# EAGLE design BaseBoard (EAGLE 9.5.1)

## Sheet 1 of 6
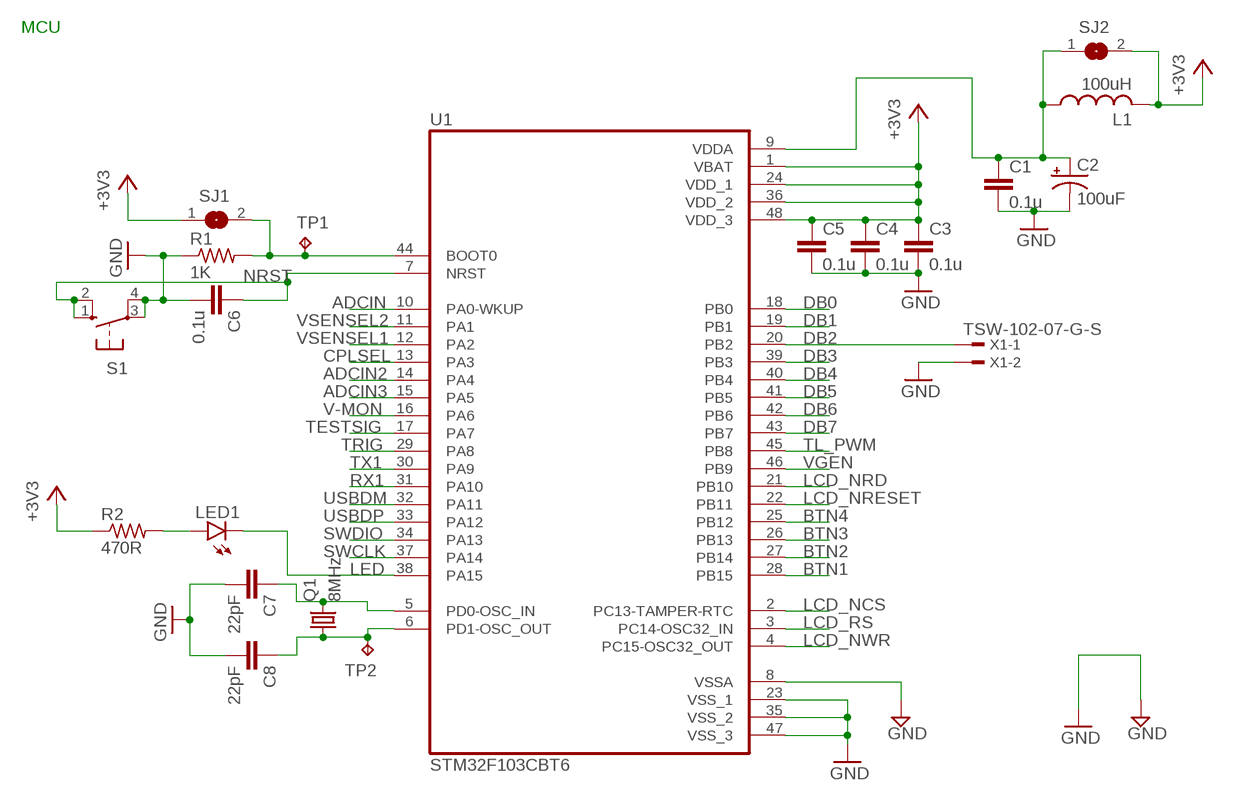
[diagram p0: schematic, sheet 1]

### Parts
C1  0.1u  C-EUC1206  [C1206]
C2  100uF  CPOL-USCT6032  [CT6032]
C3  0.1u  C-EUC1206  [C1206]
C4  0.1u  C-EUC1206  [C1206]
C5  0.1u  C-EUC1206  [C1206]
C6  0.1u  C-EUC1206  [C1206]
C7  22pF  C-EUC1206  [C1206]
C8  22pF  C-EUC1206  [C1206]
L1  100uH  L-US0204/5  [0204/5]
LED1  LEDCHIPLED_1206  [CHIPLED_1206]
Q1  8MHz  CRYSTALHC49S  [HC49/S]
R1  1K  R-US_R0805  [R0805]
R2  470R  R-US_R0805  [R0805]
S1  10-XX  [B3F-10XX]
SJ1  SJW  [SJW]
SJ2  SJW  [SJW]
TP1  TPB1,27  [B1,27]
TP2  TPB1,27  [B1,27]
U1  STM32F103CBT6  [QFP50P900X900X160-48N]
X1  TSW-102-07-G-S  [TSW-102-XX-G-S]

### Nets
+3V3: C3.1 C4.1 C5.1 L1.2 R2.1 SJ1.1 SJ2.2 U1.1(VBAT) U1.24(VDD_1) U1.36(VDD_2) U1.48(VDD_3) ; also sheet 2,3,4,5,6
ADCIN: U1.10(PA0-WKUP) ; also sheet 6
ADCIN2: U1.14(PA4) ; also sheet 6
ADCIN3: U1.15(PA5) ; also sheet 6
BTN1: U1.28(PB15) ; also sheet 5,6
BTN2: U1.27(PB14) ; also sheet 5,6
BTN3: U1.26(PB13) ; also sheet 5,6
BTN4: U1.25(PB12) ; also sheet 5,6
CPLSEL: U1.13(PA3) ; also sheet 6
DB0: U1.18(PB0) ; also sheet 3,6
DB1: U1.19(PB1) ; also sheet 3,6
DB2: U1.20(PB2) X1.1 ; also sheet 3,6
DB3: U1.39(PB3) ; also sheet 3,6
DB4: U1.40(PB4) ; also sheet 3,6
DB5: U1.41(PB5) ; also sheet 3,6
DB6: U1.42(PB6) ; also sheet 3,6
DB7: U1.43(PB7) ; also sheet 3,6
GND: C1.2 C2.- C3.2 C4.2 C5.2 C6.2 C7.2 C8.2 R1.1 S1.3(P) S1.4(P1) U1.8(VSSA) U1.23(VSS_1) U1.35(VSS_2) U1.47(VSS_3) X1.2 ; also sheet 2,3,4,5,6
LCD_NCS: U1.2(PC13-TAMPER-RTC) ; also sheet 3
LCD_NRD: U1.21(PB10) ; also sheet 3,6
LCD_NRESET: U1.22(PB11) ; also sheet 3,6
LCD_NWR: U1.4(PC15-OSC32_OUT) ; also sheet 3
LCD_RS: U1.3(PC14-OSC32_IN) ; also sheet 3
LED: LED1.C U1.38(PA15) ; also sheet 5
N$1: C1.1 C2.+ L1.1 SJ2.1 U1.9(VDDA)
N$2: LED1.A R2.2
N$21: R1.2 SJ1.2 TP1.TP U1.44(BOOT0)
N$22: C7.1 Q1.2 U1.5(PD0-OSC_IN)
N$23: C8.1 Q1.1 TP2.TP U1.6(PD1-OSC_OUT)
NRST: C6.1 S1.1(S) S1.2(S1) U1.7(NRST) ; also sheet 5
RX1: U1.31(PA10) ; also sheet 4,6
SWCLK: U1.37(PA14) ; also sheet 4,6
SWDIO: U1.34(PA13) ; also sheet 4,6
TESTSIG: U1.17(PA7) ; also sheet 4,6
TL_PWM: U1.45(PB8) ; also sheet 6
TRIG: U1.29(PA8) ; also sheet 6
TX1: U1.30(PA9) ; also sheet 4,6
USBDM: U1.32(PA11) ; also sheet 4,6
USBDP: U1.33(PA12) ; also sheet 4,6
V-MON: U1.16(PA6) ; also sheet 2,6
VGEN: U1.46(PB9) ; also sheet 2,6
VSENSEL1: U1.12(PA2) ; also sheet 6
VSENSEL2: U1.11(PA1) ; also sheet 6

### Notes on the sheet
- MCU

## Sheet 2 of 6
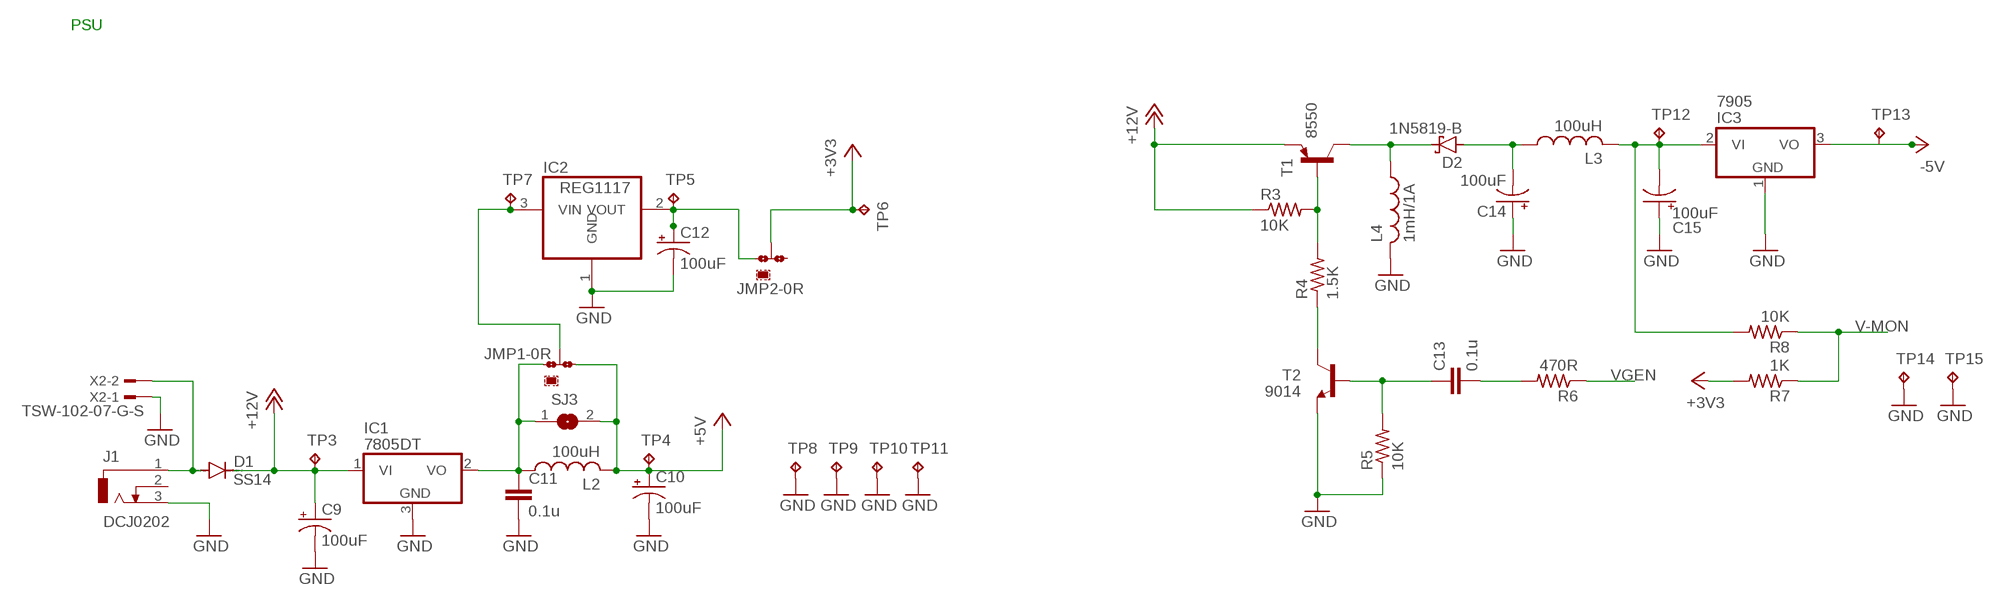
[diagram p1: schematic, sheet 2]

### Parts
C9  100uF  CPOL-USCT6032  [CT6032]
C10  100uF  CPOL-USCT6032  [CT6032]
C11  0.1u  C-EUC1206  [C1206]
C12  100uF  CPOL-USCT6032  [CT6032]
C13  0.1u  C-EUC1206  [C1206]
C14  100uF  CPOL-USCT6032  [CT6032]
C15  100uF  CPOL-USCT6032  [CT6032]
D1  SS14  ES2D  [SMB]
D2  1N5819-B  [DO41-7.6]
IC1  7805DT  [TO252]
IC2  REG1117  [SOT223]
IC3  7905  79L05Z  [TO92]
J1  DCJ0202  [DCJ0202]
JMP1  0R-JUMPA  [A0R-JMP]
JMP2  0R-JUMPA  [A0R-JMP]
L2  100uH  L-US0204/5  [0204/5]
L3  100uH  L-US0204/5  [0204/5]
L4  1mH/1A  L-US6000-XXX-RC  [6000-XXXX-RC]
R3  10K  R-US_R0805  [R0805]
R4  1.5K  R-US_R0805  [R0805]
R5  10K  R-US_R0805  [R0805]
R6  470R  R-US_R0805  [R0805]
R7  1K  R-US_R0805  [R0805]
R8  10K  R-US_R0805  [R0805]
SJ3  SJW  [SJW]
T1  8550  -PNP-TO92  [TO92]
T2  9014  -NPN-TO92  [TO92]
TP3  TPB1,27  [B1,27]
TP4  TPB1,27  [B1,27]
TP5  TPB1,27  [B1,27]
TP6  TPB1,27  [B1,27]
TP7  TPB1,27  [B1,27]
TP8  TPB1,27  [B1,27]
TP9  TPB1,27  [B1,27]
TP10  TPB1,27  [B1,27]
TP11  TPB1,27  [B1,27]
TP12  TPB1,27  [B1,27]
TP13  TPB1,27  [B1,27]
TP14  TPB1,27  [B1,27]
TP15  TPB1,27  [B1,27]
X2  TSW-102-07-G-S  [TSW-102-XX-G-S]

### Nets
+3V3: JMP2.2 R7.2 TP6.TP ; also sheet 1,3,4,5,6
+5V: C10.+ JMP1.3 L2.2 SJ3.2 TP4.TP ; also sheet 3,6
+12V: C9.+ D1.C IC1.1(VI) R3.1 T1.1(E) TP3.TP ; also sheet 3
-5V: IC3.3(VO) TP13.TP ; also sheet 6
GND: C9.- C10.- C11.2 C12.- C14.+ C15.+ IC1.3(GND) IC2.1(GND) IC3.1(GND) J1.3 L4.2 R5.1 T2.1(E) TP8.TP TP9.TP TP10.TP TP11.TP TP14.TP TP15.TP X2.1 ; also sheet 1,3,4,5,6
N$3: C11.1 IC1.2(VO) JMP1.1 L2.1 SJ3.1
N$4: R3.2 R4.2 T1.2(B)
N$5: C12.+ IC2.2(VOUT) JMP2.1 TP5.TP
N$6: R4.1 T2.3(C)
N$7: C13.1 R5.2 T2.2(B)
N$9: IC2.3(VIN) JMP1.2 TP7.TP
N$10: C13.2 R6.2
N$11: D2.C L4.1 T1.3(C)
N$12: C14.- D2.A L3.1
N$13: C15.- IC3.2(VI) L3.2 R8.2 TP12.TP
N$17: D1.A J1.1 X2.2
V-MON: R7.1 R8.1 ; also sheet 1,6
VGEN: R6.1 ; also sheet 1,6
Unconnected: J1.2 JMP2.3

### Notes on the sheet
- PSU

## Sheet 3 of 6
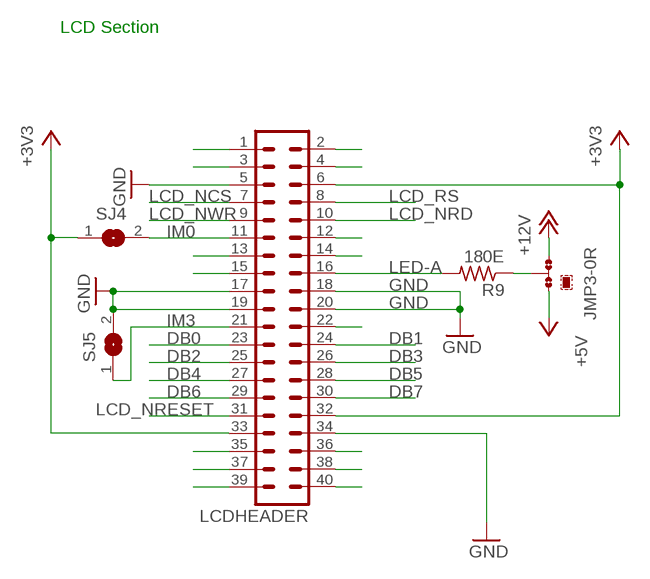
[diagram p2: schematic, sheet 3]

### Parts
JMP3  0R-JUMPA  [A0R-JMP]
LCDHEADER  MA20-2  [MA20-2]
R9  180E  R-US_R0805  [R0805]
SJ4  SJ  [SJ]
SJ5  SJ  [SJ]

### Nets
+3V3: LCDHEADER.6 LCDHEADER.32 LCDHEADER.33 SJ4.1 ; also sheet 1,2,4,5,6
+5V: JMP3.1 ; also sheet 2,6
+12V: JMP3.3 ; also sheet 2
DB0: LCDHEADER.23 ; also sheet 1,6
DB1: LCDHEADER.24 ; also sheet 1,6
DB2: LCDHEADER.25 ; also sheet 1,6
DB3: LCDHEADER.26 ; also sheet 1,6
DB4: LCDHEADER.27 ; also sheet 1,6
DB5: LCDHEADER.28 ; also sheet 1,6
DB6: LCDHEADER.29 ; also sheet 1,6
DB7: LCDHEADER.30 ; also sheet 1,6
GND: LCDHEADER.5 LCDHEADER.17 LCDHEADER.18 LCDHEADER.19 LCDHEADER.20 LCDHEADER.34 SJ5.2 ; also sheet 1,2,4,5,6
IM0: LCDHEADER.11 SJ4.2
IM3: LCDHEADER.21 SJ5.1
LCD_NCS: LCDHEADER.7 ; also sheet 1
LCD_NRD: LCDHEADER.10 ; also sheet 1,6
LCD_NRESET: LCDHEADER.31 ; also sheet 1,6
LCD_NWR: LCDHEADER.9 ; also sheet 1
LCD_RS: LCDHEADER.8 ; also sheet 1
LED-A: LCDHEADER.16 R9.2
LED-K1: LCDHEADER.15
N$14: LCDHEADER.2
N$15: LCDHEADER.4
N$16: JMP3.2 R9.1
N$19: LCDHEADER.12
N$20: LCDHEADER.14
N$28: LCDHEADER.22
N$35: LCDHEADER.36
N$36: LCDHEADER.38
N$37: LCDHEADER.40
N$38: LCDHEADER.1
N$39: LCDHEADER.3
N$44: LCDHEADER.13
N$55: LCDHEADER.35
N$56: LCDHEADER.37
N$57: LCDHEADER.39

### Notes on the sheet
- LCD Section

## Sheet 4 of 6
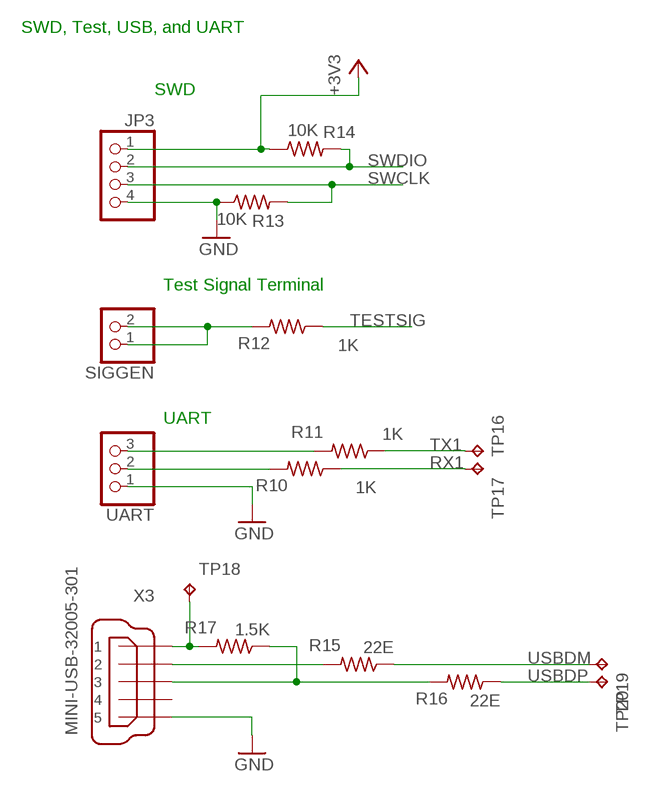
[diagram p3: schematic, sheet 4]

### Parts
JP3  PINHD-1X4  [1X04]
R10  1K  R-US_R0805  [R0805]
R11  1K  R-US_R0805  [R0805]
R12  1K  R-US_R0805  [R0805]
R13  10K  R-US_R0805  [R0805]
R14  10K  R-US_R0805  [R0805]
R15  22E  R-US_R0805  [R0805]
R16  22E  R-US_R0805  [R0805]
R17  1.5K  R-US_R0805  [R0805]
SIGGEN  PINHD-1X2  [1X02]
TP16  TPB1,27  [B1,27]
TP17  TPB1,27  [B1,27]
TP18  TPB1,27  [B1,27]
TP19  TPB1,27  [B1,27]
TP20  TPB1,27  [B1,27]
UART  PINHD-1X3  [1X03]
X3  MINI-USB-32005-301  [32005-301]

### Nets
+3V3: JP3.1 R14.1 ; also sheet 1,2,3,5,6
GND: JP3.4 R13.1 UART.1 X3.5 ; also sheet 1,2,3,5,6
N$8: R10.2 UART.2
N$18: R11.2 UART.3
N$25: R12.2 SIGGEN.1 SIGGEN.2
N$26: R17.2 TP18.TP X3.1
N$27: R16.2 R17.1 X3.3
N$29: R15.2 X3.2
RX1: R10.1 TP17.TP ; also sheet 1,6
SWCLK: JP3.3 R13.2 ; also sheet 1,6
SWDIO: JP3.2 R14.2 ; also sheet 1,6
TESTSIG: R12.1 ; also sheet 1,6
TX1: R11.1 TP16.TP ; also sheet 1,6
USBDM: R15.1 TP19.TP ; also sheet 1,6
USBDP: R16.1 TP20.TP ; also sheet 1,6
Unconnected: X3.4

### Notes on the sheet
- SWD, Test, USB, and UART
- SWD
- Test Signal Terminal
- UART

## Sheet 5 of 6
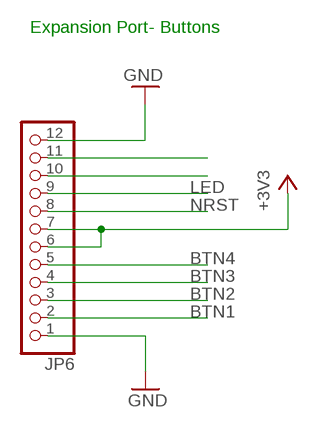
[diagram p4: schematic, sheet 5]

### Parts
JP6  PINHD-1X12  [1X12]

### Nets
+3V3: JP6.6 JP6.7 ; also sheet 1,2,3,4,6
BTN1: JP6.2 ; also sheet 1,6
BTN2: JP6.3 ; also sheet 1,6
BTN3: JP6.4 ; also sheet 1,6
BTN4: JP6.5 ; also sheet 1,6
GND: JP6.1 JP6.12 ; also sheet 1,2,3,4,6
LED: JP6.9 ; also sheet 1
N$41: JP6.10
N$42: JP6.11
NRST: JP6.8 ; also sheet 1

### Notes on the sheet
- Expansion Port- Buttons

## Sheet 6 of 6
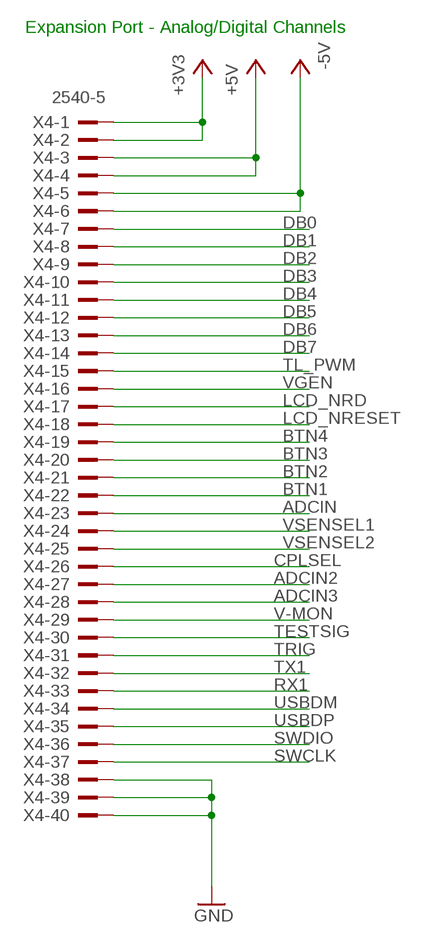
[diagram p5: schematic, sheet 6]

### Parts
X4  2540-5  [PAK100/2500-5-40]

### Nets
+3V3: X4.1 X4.2 ; also sheet 1,2,3,4,5
+5V: X4.3 X4.4 ; also sheet 2,3
-5V: X4.5 X4.6 ; also sheet 2
ADCIN: X4.23 ; also sheet 1
ADCIN2: X4.27 ; also sheet 1
ADCIN3: X4.28 ; also sheet 1
BTN1: X4.22 ; also sheet 1,5
BTN2: X4.21 ; also sheet 1,5
BTN3: X4.20 ; also sheet 1,5
BTN4: X4.19 ; also sheet 1,5
CPLSEL: X4.26 ; also sheet 1
DB0: X4.7 ; also sheet 1,3
DB1: X4.8 ; also sheet 1,3
DB2: X4.9 ; also sheet 1,3
DB3: X4.10 ; also sheet 1,3
DB4: X4.11 ; also sheet 1,3
DB5: X4.12 ; also sheet 1,3
DB6: X4.13 ; also sheet 1,3
DB7: X4.14 ; also sheet 1,3
GND: X4.38 X4.39 X4.40 ; also sheet 1,2,3,4,5
LCD_NRD: X4.17 ; also sheet 1,3
LCD_NRESET: X4.18 ; also sheet 1,3
RX1: X4.33 ; also sheet 1,4
SWCLK: X4.37 ; also sheet 1,4
SWDIO: X4.36 ; also sheet 1,4
TESTSIG: X4.30 ; also sheet 1,4
TL_PWM: X4.15 ; also sheet 1
TRIG: X4.31 ; also sheet 1
TX1: X4.32 ; also sheet 1,4
USBDM: X4.34 ; also sheet 1,4
USBDP: X4.35 ; also sheet 1,4
V-MON: X4.29 ; also sheet 1,2
VGEN: X4.16 ; also sheet 1,2
VSENSEL1: X4.24 ; also sheet 1
VSENSEL2: X4.25 ; also sheet 1

### Notes on the sheet
- Expansion Port - Analog/Digital Channels

## Library data of the parts
C1 C3-C8 C11 C13 = rcl:C-EU: CAPACITOR, European symbol; SPICEPREFIX: C
C2 C9 C10 C12 C14 C15 = rcl:CPOL-US: POLARIZED CAPACITOR, American symbol; SPICEPREFIX: C
D1 = diode:ES2D: DIODE super fast rectifier, 2 A
D2 = diode:1N581*: 1.0A SCHOTTKY BARRIER RECTIFIER Source: http://www.diodes.com/datasheets/ds23001.pdf
IC1 = linear:78*: Positive VOLTAGE REGULATOR Source: http://cache.national.com/ds/LM/LM78L05.pdf http://www.fairchildsemi.com/ds/LM/LM7805.pdf
IC2 = burr-brown:REG1117: 800mA and 1A Low Dropout (LDO) Positive Regulator 1.8V, 2.5V, 2.85V, 3.3V, 5V, and Adj; MPN: REG1117; OC_FARNELL: 1097566; OC_NEWARK: 14P6981
IC3 = linear:79*: Negative VOLTAGE REGULATOR
J1 = con-jack:DCJ0202: DC POWER JACK Source: DCJ0202.pdf; OC_FARNELL: unknown; OC_NEWARK: unknown
JMP1-JMP3 = jump-0r-smd:0R-JUMP: SMD 0R 0805 Jumper
JP3 = pinhead:PINHD-1X4: PIN HEADER
JP6 = pinhead:PINHD-1X12: PIN HEADER
L1-L4 = rcl:L-US: INDUCTOR, American symbol; SPICEPREFIX: L
LCDHEADER = con-lstb:MA20-2: PIN HEADER; OC_FARNELL: unknown; OC_NEWARK: unknown
LED1 = led:LED: LED OSRAM: - CHIPLED LG R971, LG N971, LY N971, LG Q971, LY Q971, LO R971, LY R971 LH N974, LH R974 LS Q976, LO Q976, LY Q976 LO Q996 - Hyper CHIPLED LW Q18S LB Q993, LB Q99A, LB R99A - SideLED LS A670, LO A670, LY A670, LG A670, LP A670 LB A673, LV A673, LT A673, LW A673 LH A674 LY A675 LS A676, LA A676, LO A676, LY A676, LW A676 LS A679, LY A679, LG A679 - Hyper Micro SIDELED® LS Y876, LA Y876, LO Y876, LY Y876 LT Y87S - SmartLED LW L88C, LW L88S LB L89C, LB L89S, LG L890 LS L89K, LO L89K, LY L89K LS L896, LA L896, LO L896, LY L896 - TOPLED LS T670, LO T670, LY T670, LG T670, LP T670 LSG T670, LSP T670, LSY T670, LOP T670, LYG T670 LG T671, LOG T671, LSG T671 LB T673, LV T673, LT T673, LW T673 LH T674 LS T676, LA T676, LO T676, LY T676, LB T676, LH T676, LSB T676, LW T676 LB T67C, LV T67C, LT T67C, LS T67K, LO T67K, LY T67K, LW E67C LS E67B, LA E67B, LO E67B, LY E67B, LB E67C, LV E67C, LT E67C LW T67C LS T679, LY T679, LG T679 LS T770, LO T770, LY T770, LG T770, LP T770 LB T773, LV T773, LT T773, LW T773 LH T774 LS E675, LA E675, LY E675, LS T675 LS T776, LA T776, LO T776, LY T776, LB T776 LHGB T686 LT T68C, LB T68C - Hyper Mini TOPLED® LB M676 - Mini TOPLED Santana® LG M470 LS M47K, LO M47K, LY M47K Source: http://www.osram.convergy.de LUXEON: - LUMILED® LXK2-PW12-R00, LXK2-PW12-S00, LXK2-PW14-U00, LXK2-PW14-V00 LXK2-PM12-R00, LXK2-PM12-S00, LXK2-PM14-U00 LXK2-PE12-Q00, LXK2-PE12-R00, LXK2-PE12-S00, LXK2-PE14-T00, LXK2-PE14-U00 LXK2-PB12-K00, LXK2-PB12-L00, LXK2-PB12-M00, LXK2-PB14-N00, LXK2-PB14-P00, LXK2-PB14-Q00 LXK2-PR12-L00, LXK2-PR12-M00, LXK2-PR14-Q00, LXK2-PR14-R00 LXK2-PD12-Q00, LXK2-PD12-R00, LXK2-PD12-S00 LXK2-PH12-R00, LXK2-PH12-S00 LXK2-PL12-P00, LXK2-PL12-Q00, LXK2-PL12-R00 Source: www.luxeon.com KINGBRIGHT: KA-3528ASYC Source: www.kingbright.com
Q1 = crystal:CRYSTAL: CRYSTAL; OC_FARNELL: 1667008; OC_NEWARK: unknown
R1-R17 = rcl:R-US_: RESISTOR, American symbol; SPICEPREFIX: R
S1 = switch-omron:10-XX: OMRON SWITCH; MPN: B3F-1000; OC_FARNELL: 176432; OC_NEWARK: 36M3542
SIGGEN = pinhead:PINHD-1X2: PIN HEADER
SJ1-SJ5 = jumper:SJ: SMD solder JUMPER
T1 = transistor:*-PNP-: PNP Transistror
T2 = transistor:*-NPN-: NPN Transistror BF959 corrected 2008.03.06
TP1-TP20 = testpad:TP: Test pad
U1 = STM32F103CBT6:STM32F103CBT6: Mainstream Performance line, ARM Cortex-M3 MCU with 128 Kbytes Flash, 72 MHz CPU, motor control, USB and CAN Check prices <https://pricing.snapeda.com/parts/STM32F103CBT6/STMicroelectronics/view-part?ref=eda>; AVAILABILITY: In Stock; DESCRIPTION: ARM® Cortex®-M3 STM32F1 Microcontroller IC 32-Bit 72MHz 128KB (128K x 8) FLASH; MF: STMicroelectronics; MP: STM32F103CBT6; PACKAGE: LQFP-48 STMicroelectronics; PRICE: None; PURCHASE-URL: https://pricing.snapeda.com/search/part/STM32F103CBT6/?ref=eda
UART = pinhead:PINHD-1X3: PIN HEADER
X1 X2 = con-samtec:TSW-102-*-G-S: THROUGH-HOLE .025" SQ POST HEADER Source: Samtec TSW.pdf; MF: Samtec Inc.; MPN: TSW-102-07-G-S
X3 = con-cypressindustries:MINI-USB-: MINI USB-B Conector Source: www.cypressindustries.com; OC_FARNELL: unknown; OC_NEWARK: unknown
X4 = con-3m:2540-: 3M (TM) Pak 100 4-Wall Header Source: 3M; OC_FARNELL: 9838414; OC_NEWARK: unknown

## Board
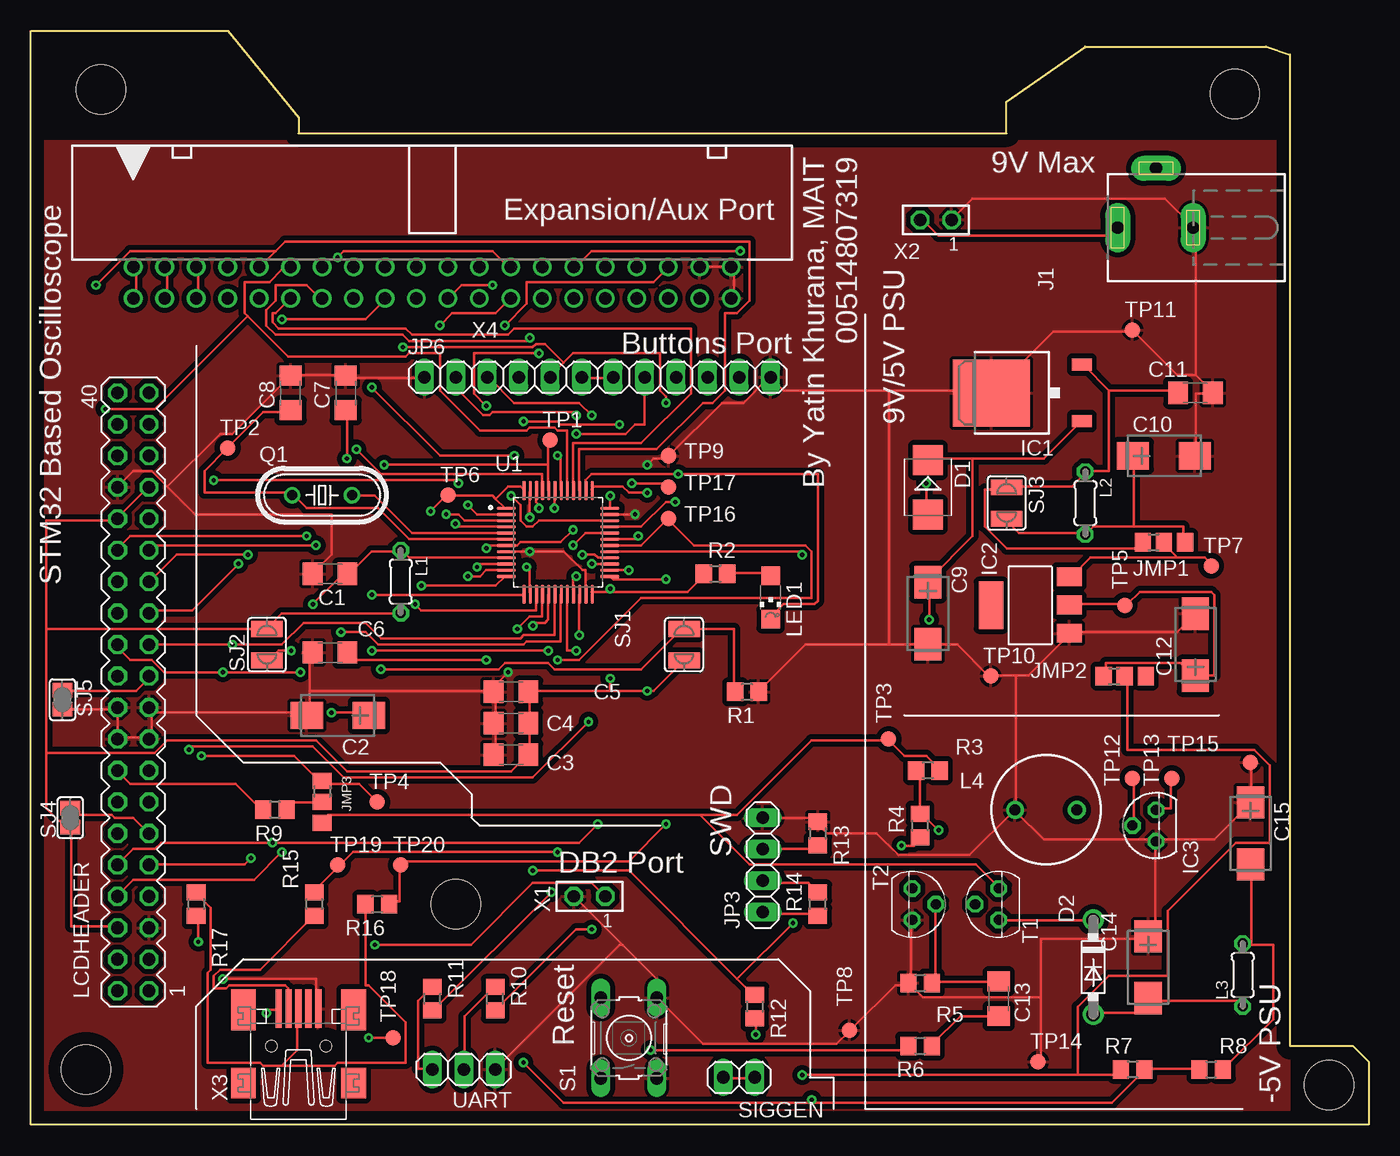
[diagram p6: board, top side]
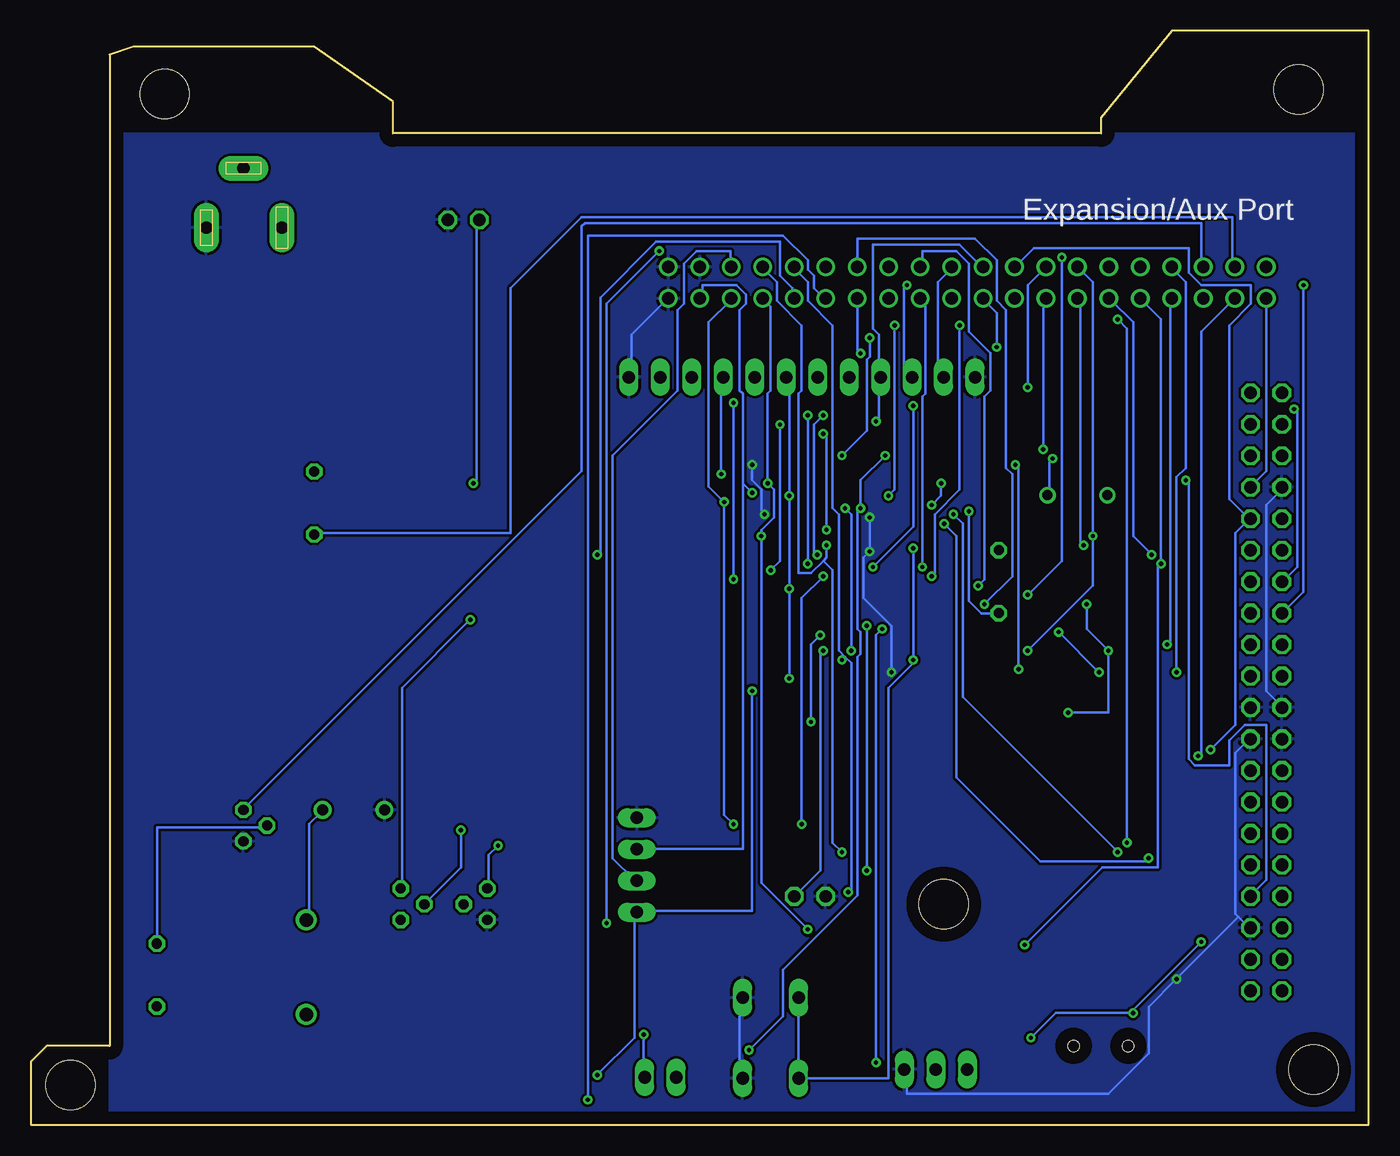
[diagram p7: board, bottom side, seen from below]

Size 107.95 x 88.27 mm. Coordinates in mm from the lower left corner, seen from the top.
Outline: 0,0 0,88.27 15.88,88.27 21.59,81.28 21.59,80.01 78.74,80.01 78.74,82.55 85.09,87 99.69,87 101.6,86.36 101.6,6.35 106.68,6.35 107.95,5.08 107.95,0 0,0
Copper layers (1*16): Top 0.035mm / dielectric 1.5mm / Bottom 0.035mm
Design rules "default *": minimum track width 8mil, minimum drill 0.35mm, track to track 8mil, track to pad 8mil, pad to pad 7mil, via to via 10mil, smd to smd 6mil, copper to edge 40mil, drill to drill 6mil, minimum pad ring 10mil, minimum via ring 8mil, stop-mask expansion 4mil, vias tented up to drill 0mil, thermal gap 10mil

### Footprints (pad centres in the part's own frame; a part is rotated, then mirrored left to right if it is on the bottom)
C1206 = smd 1.6 x 1.8: 1 -1.4,0; 2 1.4,0
CT6032 = smd 2.6 x 2.2: + -2.5,0; - 2.5,0
SMB = smd 2.4 x 2.4: A 2.2,0; C -2.2,0
DO41-7.6 = drill 1.1 pad 1.7: A 3.81,0; C -3.81,0
TO252 = smd 1 x 1.6: 1 -2.28,-4.8; 2 2.28,-4.8 | smd 5.4 x 6.2: 3 0,2.5
SOT223 = smd 1.499 x 2.007: 1 -2.261,-3.15; 2 0.025,-3.15; 3 2.311,-3.15 | smd 3.81 x 2.007: 4 0,3.15
TO92 = drill 0.813 octagon: 1 -1.27,0; 2 0,1.905; 3 1.27,0
DCJ0202 = drill 1 pad 2 long: 1 0,3.1; 2 4.8,0; 3 0,-3
A0R-JMP = smd 1.5 x 1.3: 1 0,1.7; 2 0,0; 3 0,-1.7
1X04 = drill 1.016 long: 1 -3.81,0; 2 -1.27,0; 3 1.27,0; 4 3.81,0
1X12 = drill 1.016 long: 1 -13.97,0; 2 -11.43,0; 3 -8.89,0; 4 -6.35,0; 5 -3.81,0; 6 -1.27,0; 7 1.27,0; 8 3.81,0; 9 6.35,0; 10 8.89,0; 11 11.43,0; 12 13.97,0
0204/5 = drill 0.813 octagon: 1 -2.54,0; 2 2.54,0
6000-XXXX-RC = drill 0.9 pad 1.422: 1 -2.5,0; 2 2.5,0
MA20-2 = drill 1.016 octagon: 1 -24.13,-1.27; 2 -24.13,1.27; 3 -21.59,-1.27; 4 -21.59,1.27; 5 -19.05,-1.27; 6 -19.05,1.27; 7 -16.51,-1.27; 8 -16.51,1.27; 9 -13.97,-1.27; 10 -13.97,1.27; 11 -11.43,-1.27; 12 -11.43,1.27; 13 -8.89,-1.27; 14 -8.89,1.27; 15 -6.35,-1.27; 16 -6.35,1.27; 17 -3.81,-1.27; 18 -3.81,1.27; 19 -1.27,-1.27; 20 -1.27,1.27; 21 1.27,-1.27; 22 1.27,1.27; 23 3.81,-1.27; 24 3.81,1.27; 25 6.35,-1.27; 26 6.35,1.27; 27 8.89,-1.27; 28 8.89,1.27; 29 11.43,-1.27; 30 11.43,1.27; 31 13.97,-1.27; 32 13.97,1.27; 33 16.51,-1.27; 34 16.51,1.27; 35 19.05,-1.27; 36 19.05,1.27; 37 21.59,-1.27; 38 21.59,1.27; 39 24.13,-1.27; 40 24.13,1.27
CHIPLED_1206 = smd 1.5 x 1.5: A 0,-1.75; C 0,1.75
HC49/S = drill 0.813: 1 -2.413,0; 2 2.413,0
R0805 = smd 1.3 x 1.5: 1 -0.95,0; 2 0.95,0
B3F-10XX = drill 1.016 long: 1 -3.251,2.261; 2 3.251,2.261; 3 -3.251,-2.261; 4 3.251,-2.261
1X02 = drill 1.016 long: 1 -1.27,0; 2 1.27,0
SJW = smd 1.27 x 2.54: 1 -1.27,0; 2 1.27,0
SJ = smd 1.168 x 1.6: 1 -0.762,0; 2 0.762,0
TO92' = drill 0.813 octagon: 1 1.27,0; 2 0,1.905; 3 -1.27,0
B1,27 = smd 1.27 x 1.27: TP 0,0
QFP50P900X900X160-48N = smd 1.56 x 0.28: 1 -4.18,2.75; 2 -4.18,2.25; 3 -4.18,1.75; 4 -4.18,1.25; 5 -4.18,0.75; 6 -4.18,0.25; 7 -4.18,-0.25; 8 -4.18,-0.75; 9 -4.18,-1.25; 10 -4.18,-1.75; 11 -4.18,-2.25; 12 -4.18,-2.75; 25 4.18,-2.75; 26 4.18,-2.25; 27 4.18,-1.75; 28 4.18,-1.25; 29 4.18,-0.75; 30 4.18,-0.25; 31 4.18,0.25; 32 4.18,0.75; 33 4.18,1.25; 34 4.18,1.75; 35 4.18,2.25; 36 4.18,2.75 | smd 0.28 x 1.56: 13 -2.75,-4.18; 14 -2.25,-4.18; 15 -1.75,-4.18; 16 -1.25,-4.18; 17 -0.75,-4.18; 18 -0.25,-4.18; 19 0.25,-4.18; 20 0.75,-4.18; 21 1.25,-4.18; 22 1.75,-4.18; 23 2.25,-4.18; 24 2.75,-4.18; 37 2.75,4.18; 38 2.25,4.18; 39 1.75,4.18; 40 1.25,4.18; 41 0.75,4.18; 42 0.25,4.18; 43 -0.25,4.18; 44 -0.75,4.18; 45 -1.25,4.18; 46 -1.75,4.18; 47 -2.25,4.18; 48 -2.75,4.18
DRILL_0.1560 = hole 3.962: 0,0
1X03 = drill 1.016 long: 1 -2.54,0; 2 0,0; 3 2.54,0
TSW-102-XX-G-S = drill 1 pad 1.5 octagon: 1 1.27,0; 2 -1.27,0
32005-301 = smd 3.1 x 0.5: 1 3,1.6; 2 3,0.8; 3 3,0; 4 3,-0.8; 5 3,-1.6 | smd 2.5 x 2: M1 -3,-4.45; M2 -3,4.45 | smd 3.3 x 2: M3 2.9,4.45; M4 2.9,-4.45 | hole 0.9: 0,2.2; 0,-2.2
PAK100/2500-5-40 = drill 1 pad 1.422: 1 -24.13,-1.27; 2 -24.13,1.27; 3 -21.59,-1.27; 4 -21.59,1.27; 5 -19.05,-1.27; 6 -19.05,1.27; 7 -16.51,-1.27; 8 -16.51,1.27; 9 -13.97,-1.27; 10 -13.97,1.27; 11 -11.43,-1.27; 12 -11.43,1.27; 13 -8.89,-1.27; 14 -8.89,1.27; 15 -6.35,-1.27; 16 -6.35,1.27; 17 -3.81,-1.27; 18 -3.81,1.27; 19 -1.27,-1.27; 20 -1.27,1.27; 21 1.27,-1.27; 22 1.27,1.27; 23 3.81,-1.27; 24 3.81,1.27; 25 6.35,-1.27; 26 6.35,1.27; 27 8.89,-1.27; 28 8.89,1.27; 29 11.43,-1.27; 30 11.43,1.27; 31 13.97,-1.27; 32 13.97,1.27; 33 16.51,-1.27; 34 16.51,1.27; 35 19.05,-1.27; 36 19.05,1.27; 37 21.59,-1.27; 38 21.59,1.27; 39 24.13,-1.27; 40 24.13,1.27

### Placement (x,y rotation side)
C1  24.13,44.45 180 top
C2  24.77,33.02 180 top
C3  38.73,29.84 180 top
C4  38.73,32.38 180 top
C5  38.73,34.92 180 top
C6  24.13,38.1 180 top
C7  25.4,59.05 90 top
C8  20.95,59.05 90 top
C9  72.39,41.27 270 top
C10  91.44,53.98 0 top
C11  93.98,59.05 0 top
C12  93.98,38.73 90 top
C13  78.11,10.16 270 top
C14  90.17,12.7 270 top
C15  98.42,23.5 270 top
D1  72.39,51.44 270 top
D2  85.72,12.7 270 top
IC1  80.01,59.05 90 top
IC2  80.64,41.91 90 top
IC3  90.81,24.13 90 top
J1  90.81,72.39 90 top
JMP1  91.44,46.99 90 top
JMP2  88.27,36.2 90 top
JMP3  23.5,26.04 0 top
JP3  59.05,20.95 90 top
JP6  45.72,60.33 0 top
L1  29.84,43.81 270 top
L2  85.09,50.16 270 top
L3  97.79,12.06 90 top
L4  81.92,25.4 180 top
LCDHEADER  8.26,34.92 90 top
LED1  59.69,42.55 180 top
Q1  23.5,50.8 0 top
R1  57.78,34.92 180 top
R2  55.24,44.45 0 top
R3  72.39,28.57 180 top
R4  71.75,24.13 90 top
R5  71.75,11.43 0 top
R6  71.75,6.35 0 top
R7  88.9,4.45 180 top
R8  95.25,4.45 0 top
R9  19.68,25.4 180 top
R10  37.47,10.16 90 top
R11  32.38,10.16 90 top
R12  58.42,9.53 270 top
R13  63.5,23.5 270 top
R14  63.5,17.78 90 top
R15  22.86,17.78 270 top
R16  27.94,17.78 180 top
R17  13.34,17.78 270 top
S1  48.26,6.99 90 top
SIGGEN  57.15,3.81 0 top
SJ1  52.7,38.73 90 top
SJ2  19.05,38.73 90 top
SJ3  78.74,50.16 270 top
SJ4  3.17,24.77 90 top
SJ5  2.54,34.29 270 top
T1  8550  [TO92']  78.11,17.78 90 top
T2  9014  [TO92']  71.12,17.78 270 top
TP1  41.91,55.24 0 top
TP2  15.88,54.61 0 top
TP3  69.22,31.11 90 top
TP4  27.94,26.04 0 top
TP5  88.27,41.91 0 top
TP6  33.66,50.8 0 top
TP7  95.25,45.09 0 top
TP8  66.04,7.62 0 top
TP9  51.44,53.98 0 top
TP10  77.47,36.2 0 top
TP11  88.9,64.14 0 top
TP12  88.9,27.94 90 top
TP13  92.08,27.94 0 top
TP14  81.28,5.08 0 top
TP15  98.42,29.21 90 top
TP16  51.44,48.9 0 top
TP17  51.44,51.44 0 top
TP18  29.21,6.99 0 top
TP19  24.77,20.95 0 top
TP20  29.84,20.95 0 top
U1  42.55,46.99 0 top
U$1  [DRILL_0.1560]  4.45,4.45 0 top
U$2  [DRILL_0.1560]  5.65,83.54 0 top
U$3  [DRILL_0.1560]  97.16,83.19 0 top
U$4  [DRILL_0.1560]  34.29,17.78 0 top
U$5  [DRILL_0.1560]  104.78,3.17 0 top
UART  34.92,4.45 180 top
X1  45.09,18.41 0 top
X2  73.03,73.03 0 top
X3  21.59,6.35 90 top
X4  32.38,67.94 0 top

### Tracks (layer width: path | path; a pad name or v marks a point on that pad's centre or on a via)
+3V3  (via drill 0.35)
  Top 0.203: R14.1 63.5,17 59.25,17 JP3.1 | v62.25,4 84.5,4 | 84.5,4 87.5,4 87.75,4.25 R7.2 | 84.5,4 84.5,9.5 87,12 91.75,12 91.75,17.25 97.25,22.75 100,22.75 100,29 98.75,30.25 88.5,30.25 88.5,36 JMP2.2 | 46.75,35 40.25,35 C5.1 40.25,34.75 40.25,32.5 C4.1 40.25,32.25 40.25,30 C3.1 40,29.75 38.75,28.5 25.5,28.5 23,31 11,31 10,30 1.25,30 | 46.75,35 v49.75,35 50.25,35 52.5,37.25 SJ1.1 | 46.75,43 45.25,43 U1.24 | 46.75,43 53,43 54.25,44.25 R2.1 | v46.75,50.75 46.75,49.75 U1.36 | JP6.6 44.5,60.25 46.75,60.25 JP6.7 | v46.75,43.25 46.75,43 | v46.75,36 46.75,35 | 37.5,50.5 38.25,49.75 U1.1 | 37.5,50.5 37.25,50.75 33.75,50.75 TP6.TP 33.5,50.75 v32.25,49.5 | 37.5,50.5 38.5,51.5 39.5,51.5 39.75,51.25 U1.48 | L1.2 29.75,41.25 20.25,41.25 19.25,40.25 SJ2.2 19,40 1.25,40 | LCDHEADER.6 6.75,16 3.25,16 3.25,24 SJ4.1 3,24.25 2.75,24.5 2.25,24.5 1.25,25.5 1.25,30 | X4.1 8.5,66.75 8.5,69 X4.2 | LCDHEADER.33 9.5,51.25 9.25,51.25 7,49 LCDHEADER.32 6.75,48.75 1.25,48.75 1.25,40 | 1.25,40 1.25,30
  Bottom 0.203: v62.25,4 59.25,7 59.25,17 JP3.1 59,17.25 49.75,17.25 v49.75,35 | JP6.7 46.75,60.25 v46.75,50.75 v46.75,43.25 v46.75,36 | v32.25,49.5 32.25,42.25 31.25,41.25 30,41.25 L1.2 | X4.1 8.25,66.5 8.25,52.75 9.5,51.5 LCDHEADER.33
+5V  (via drill 0.35)
  Top 0.203: 89,48.25 85.75,48.25 85.25,47.75 L2.2 85,47.75 79.75,47.75 78.75,48.75 SJ3.2 | 89,48.25 93,48.25 93,47 JMP1.3 | 89,48.25 89,53.75 C10.+ | TP4.TP 27.75,26.25 26.5,27.5 23.5,27.5 JMP3.1 23.25,27.75 21.25,29.75 v13.75,29.75 | X4.3 11,66.75 11,69 X4.4
  Bottom 0.203: v13.75,29.75 13.5,30 13.5,64 11,66.5 X4.3 | L2.2 85,47.75 69.25,47.75 69.25,67.5 63.5,73.25 11,73.25 11,69.25 X4.4
+12V  (via drill 0.35)
  Top 0.203: 76,53.75 72.5,53.75 D1.C | 76,53.75 81.75,53.75 84.75,56.75 IC1.1 | 76,53.75 76,47.5 72.5,44 C9.+ 72.5,43.75 v72.5,40.75 | R3.1 73.25,28.75 72.25,29.75 70.5,29.75 69.25,31 TP3.TP 69,31 63,31 57,25 54,25 | 54,25 24,25 23.5,24.5 JMP3.3 | 54,25 58,21 76.25,21 78,19.25 T1.1
  Bottom 0.203: v72.5,40.75 78,35.25 78,19.25 T1.1
-5V
  Top 0.203: TP13.TP 92,27.75 92,25.5 91,25.5 IC3.3 | X4.5 13.5,66.75 13.5,69 X4.6
  Bottom 0.203: IC3.3 90.75,25.5 63.5,52.75 63.5,72.5 63.25,72.75 13.5,72.75 13.5,69.25 X4.6
ADCIN  (via drill 0.35)
  Top 0.203: v36,45 36.25,45.25 38.25,45.25 U1.10
  Bottom 0.203: v36,45 36,58.75 35.75,59 35.75,66.25 36,66.5 X4.23
ADCIN2  (via drill 0.35)
  Top 0.203: v40,45 40.25,45 40.25,43 U1.14 | v36.75,58 35.75,59 35.75,62.25 v41,62.25
  Bottom 0.203: v40,45 36.75,48.25 v36.75,58 | v41,62.25 41.25,62.5 41.25,66.5 X4.27
ADCIN3  (via drill 0.35)
  Top 0.203: v31,42 31.5,41.5 40.75,41.5 40.75,42.75 U1.15
  Bottom 0.203: v31,42 28.75,44.25 28.75,52.5 29.25,53 29.25,65.75 30,66.5 30,69.75 31.75,71.5 41.25,71.5 41.25,69.25 X4.28
BTN1  (via drill 0.35)
  Top 0.203: v44.5,46 45.5,46 45.75,45.75 46.5,45.75 U1.28 | v44,57.25 43.75,57.5 37.25,57.5 37,57.25 36.5,57.25 34.5,59.25 34.5,60.25 JP6.2
  Bottom 0.203: v44.5,46 44.75,46.25 44.75,56.5 v44,57.25 | X4.22 33.75,69 34.75,68 34.75,60.75 34.5,60.5 JP6.2
BTN2  (via drill 0.35)
  Top 0.203: v45.25,45.25 46.5,45.25 U1.27 | v45.25,57.25 44.25,58.25 39,58.25 37,60.25 JP6.3 | v37.25,67.75 34.75,67.75 33.75,66.75 X4.21
  Bottom 0.203: v45.25,57.25 v45.25,45.25 | v37.25,67.75 37.5,67.5 37.5,61 37,60.5 JP6.3
BTN3  (via drill 0.35)
  Top 0.203: v48.25,44.75 46.75,44.75 U1.26 | v47.5,56.5 42.75,56.5 42.5,56.75 v39.75,56.75
  Bottom 0.203: v48.25,44.75 47.5,45.5 v47.5,56.5 | v39.75,56.75 39.5,57 39.5,60.25 JP6.4 39.5,60.5 39.5,63.75 40,64.25 40,71 33,71 31.25,69.25 X4.20
BTN4  (via drill 0.35)
  Top 0.203: v51.25,44 47,44 46.75,44.25 U1.25 | v51.25,58.25 51.25,58.75 50.75,59.25 50.75,62.25 43.75,62.25 43,61.5 | 43,61.5 42,60.5 JP6.5 | v30,62.75 40.5,62.75 40.75,63 41.5,63 43,61.5
  Bottom 0.203: v51.25,58.25 v51.25,44 | v30,62.75 30,65.5 31,66.5 X4.19
CPLSEL  (via drill 0.35)
  Top 0.203: v27.5,42.75 39.75,42.75 U1.13 | v24.75,70 25.25,70.5 37.25,70.5 38.5,69.25 X4.26
  Bottom 0.203: v27.5,42.75 24.75,45.5 v24.75,70
DB0  (via drill 0.35)
  Top 0.203: U1.18 42.25,42.75 42.25,39.5 39.75,39.5 39.5,39.25 28.25,39.25 27,40.5 22,40.5 20.25,38.75 v16.25,38.75 9.75,38.75 LCDHEADER.23
  Bottom 0.203: v16.25,38.75 16,39 16,66.5 X4.7
DB1  (via drill 0.35)
  Top 0.203: v25,39.75 27,39.75 28,38.75 39.75,38.75 40,39 42.75,39 42.75,42.75 U1.19 | v21.75,36.5 v15.5,36.5 10.75,36.5 9.75,37.5 8,37.5 7,38.5 LCDHEADER.24
  Bottom 0.203: v21.75,36.5 v25,39.75 | v15.5,36.5 15.5,52.25 14.75,53 14.75,68 15.75,69 X4.8
DB2  (via drill 0.35)
  Top 0.203: v44,38.25 43.25,38.25 43.25,42.75 U1.20 | v16.75,45.25 13,41.5 9.75,41.5 LCDHEADER.25 | v27.75,14.5 35.5,14.5 40.5,19.5 45.25,19.5 46.25,18.5 X1.1
  Bottom 0.203: v44,38.25 44.25,38 44.25,20.5 46.25,18.5 X1.1 | X4.9 18.25,66.5 16.75,65 v16.75,45.25 17,45 17,20.75 21.5,20.75 v27.75,14.5
DB3  (via drill 0.35)
  Top 0.203: 19.75,70.5 18.5,69.25 X4.10 | 19.75,70.5 20.5,71.25 58,71.25 58,66.5 57,65.5 56,65.5 56,59.25 55,58.25 54.25,58.25 50.5,54.5 44.25,54.5 44.25,51.25 U1.39 | v5.25,67.75 8,70.5 19.75,70.5
  Bottom 0.203: v5.25,67.75 5.25,43 6.75,41.5 LCDHEADER.26
DB4  (via drill 0.35)
  Top 0.203: U1.40 43.75,51.25 43.75,55 49.25,55 53.25,59 53.25,64.25 39,64.25 38.5,63.75 30.75,63.75 30.25,64.25 20,64.25 19.5,64.75 19.5,65.5 19.75,65.5 20.75,66.5 X4.11 | v17.5,46 11.75,46 9.75,44 LCDHEADER.27
  Bottom 0.203: v17.5,46 19,47.5 19,64.75 20.75,66.5 X4.11
DB5  (via drill 0.35)
  Top 0.203: 17.5,65.25 17.25,65.5 17.25,68 19.25,68 20.25,69 20.75,69 X4.12 | 17.5,65.25 20.75,62 30.25,62 30.5,62.25 33,62.25 33,59.25 36.25,56 40,56 40.25,56.25 42.25,56.25 42.5,56 43.25,56 43.25,51.25 U1.41 | v6,57.75 10,57.75 17.5,65.25
  Bottom 0.203: v6,57.75 5.75,57.5 5.75,45 6.75,44 LCDHEADER.28
DB6  (via drill 0.35)
  Top 0.203: v42.5,54 42.75,54 42.75,51.25 U1.42 | v40.25,63.5 40,63.25 30.5,63.25 30,63.75 19.75,63.75 19,64.5 19,65.75 19.75,66.5 19.75,67.75 22.25,67.75 23.25,66.75 X4.13 | v23,46.75 10,46.75 9.75,46.5 LCDHEADER.29
  Bottom 0.203: v42.5,54 40.5,56 40.5,61.75 40.25,62 v40.25,63.5 | v23,46.75 23.25,47 23.25,66.5 X4.13
DB7  (via drill 0.35)
  Top 0.203: v42.25,49.75 42.25,51 U1.43 | v27.5,38.25 v41.75,38.25 | v22.25,47.5 8,47.5 7,46.5 LCDHEADER.30
  Bottom 0.203: v42.25,49.75 41.75,49.25 v41.75,38.25 | v27.5,38.25 22.25,43.5 v22.25,47.5 22.25,68 23.25,69 X4.14
GND  (via drill 0.35)
  Top 0.203: U1.23 44.75,43 44.75,44.75 44.5,44.75 43,46.25 v40.25,46.25 38.5,46.25 U1.8 | v40.25,49 40.25,51 U1.47 | C3.2 37.5,30 37.5,32.25 C4.2 37.5,32.5 37.5,34.75 C5.2 | 22.5,35 22.5,33.25 C2.- 22.25,33.25 9.75,33.25 | 22.5,35 22.5,38 C6.2 | 22.5,35 37,35 | 37,35 37.25,35 C5.2 | 37,35 v38.5,36.5 | 37,35 C5.2 | JP6.1 31.75,60.25 25.5,60.25 C7.2 25.25,60.5 21,60.5 C8.2 16.25,55.75 15.25,55.75 11,51.5 | 11,51.5 9.75,52.75 8.25,52.75 7,51.5 LCDHEADER.34 | 11,51.5 13.25,49.25 24.25,49.25 24.25,46 22.75,44.5 C1.2 | SJ5.2 2.75,33.5 6.75,33.5 LCDHEADER.20 7,33.5 7,31.25 | 9.75,33.25 9.75,31.25 LCDHEADER.17 9.5,31.25 7,31.25 | 9.75,33.25 9.75,33.5 LCDHEADER.19 9.75,33.25 | v15.5,11.75 23,11.75 23,9.5 X3.5 | 7,31.25 LCDHEADER.18 | X4.39 56.75,66.75 56.75,69 X4.40 56.5,69.25 54,69.25 X4.38 | v48.75,49.25 46.75,49.25 U1.35 | v49.75,53.25 50.25,53.75 51.25,53.75 TP9.TP 51.5,54 55.75,58.25 57.5,58.25 59.5,60.25 JP6.12 59.75,60.25 60.75,59.25 69.25,59.25 | X2.1 74.5,73.25 76,74.75 91.5,74.75 93.75,72.5 J1.3 94,72.25 94,60.5 | 94,60.5 92.5,60.5 89,64 TP11.TP 88.75,64 82.5,64 77.75,59.25 IC1.3 77.5,59.25 69.25,59.25 | 94,60.5 95.25,59.25 C11.2 95.25,59 94,59 94,54 C10.- | JP3.4 59.25,24.75 63.25,24.75 63.5,24.5 R13.1 63.5,24.25 64.25,23.5 68.25,23.5 70,21.75 75.75,21.75 79.25,25.25 L4.2 | 69.25,38.75 72.25,38.75 C9.- 72.5,38.75 74.75,38.75 77.25,36.25 TP10.TP 77.5,36.25 79.5,36.25 | 69.25,38.75 62.5,38.75 58.75,35 R1.1 | 79.5,36.25 80.5,36.25 83.75,39.5 IC2.1 84,39.75 92.5,39.75 93.75,41 C12.- | 79.5,36.25 79.5,25.5 L4.2 | 47.75,14.5 50.5,11.75 50.5,10.25 S1.4 50.75,10 54.25,6.5 65,6.5 66,7.5 TP8.TP 66.25,7.75 69.75,11.25 70.75,11.25 R5.1
  Top 0.203: 47.75,14.5 44,18.25 X1.2 | 47.75,14.5 47.5,14.5 37.5,4.5 UART.1 | T2.1 71,16.5 71,11.5 R5.1 | TP15.TP 98.5,29 98.5,26 C15.+ 98.25,25.75 95.5,23 91,23 IC3.1 | 81.5,10.25 81.5,15 90,15 C14.+ 90.25,15.25 90.75,15.25 90.75,22.75 IC3.1 | 81.5,10.25 81.5,5.25 TP14.TP | 81.5,10.25 72,10.25 71,11.25 R5.1 | L4.2 79.5,25.25 81.75,23 90.75,23 IC3.1 | 69.25,38.75 69.25,59.25
  Bottom 0.203: v40.25,49 v40.25,46.25 40.75,45.75 40.75,42.5 38.5,40.25 v38.5,36.5 | 10.5,16.75 10.75,17 10.75,30 9.75,31 LCDHEADER.17 | 10.5,16.75 9.75,16 LCDHEADER.5 | 10.5,16.75 v15.5,11.75 17.75,9.5 17.75,5.75 21,2.5 37.25,2.5 37.25,4.25 UART.1 | LCDHEADER.34 7,51.25 8.25,50 8.25,35 7,33.75 LCDHEADER.20 | v48.75,49.25 49,49.5 49,51.25 49.75,52 v49.75,53.25 | X4.39 56.75,66.5 59.5,63.75 59.5,60.5 JP6.12 | S1.3 50.75,3.75 50.75,10 S1.4
  pour Top (isolate 0.406): 0,79.38 0,0 101.6,0 101.6,79.38
  pour Bottom: 0,80.01 0,0 101.6,0 101.6,80.01
IM0
  Top 0.203: SJ4.2 3.25,25.5 3.75,25 6.5,25 6.75,24.75 8.25,24.75 9.5,23.5 LCDHEADER.11
IM3
  Top 0.203: SJ5.1 2.75,35 8.5,35 9.5,36 LCDHEADER.21
LCD_NCS  (via drill 0.35)
  Top 0.203: v35.25,50 36,49.25 38.25,49.25 U1.2 | v34.5,51.75 34.25,52 v14.75,52
  Bottom 0.203: v35.25,50 34.5,50.75 v34.5,51.75 | v14.75,52 14.5,51.75 14.5,29.5 14,29 11.25,29 11.25,31 10,32.25 8.25,32.25 8.25,19.75 9.5,18.5 LCDHEADER.7
LCD_NRD  (via drill 0.35)
  Top 0.203: v44,44.25 43.75,44.25 43.75,43 U1.21 | v45.75,24.25 44.25,22.75 v19.5,22.75 10.5,22.75 10,22.25 8.25,22.25 7,21 LCDHEADER.10 | v20.25,65 27,65 28.5,66.5 X4.17
  Bottom 0.203: v44,44.25 45.75,42.5 v45.75,24.25 | v20.25,65 19.5,64.25 v19.5,22.75
LCD_NRESET  (via drill 0.35)
  Top 0.203: v44.25,39.5 44.25,42.75 U1.22 | v45,32.5 40.5,28 25.25,28 22.75,30.5 13,30.5 v12.75,30.25
  Bottom 0.203: v44.25,39.5 45,38.75 v45,32.5 | v12.75,30.25 10.75,32.25 10.75,47.75 9.75,48.75 LCDHEADER.31 9.75,49 11.25,50.5 11.25,64.5 9.5,66.25 9.5,67.75 13.5,67.75 14.5,68.75 14.5,70.75 27,70.75 28.5,69.25 X4.18
LCD_NWR  (via drill 0.35)
  Top 0.203: v34.25,48.5 34.5,48.25 38.25,48.25 U1.4 | v17.75,21.5 17.25,21 9.75,21 LCDHEADER.9
  Bottom 0.203: v34.25,48.5 33.25,47.5 33.25,28 26.5,21.25 17.75,21.25 v17.75,21.5
LCD_RS  (via drill 0.35)
  Top 0.203: v33.5,49.25 34.5,49.25 35,48.75 38.25,48.75 U1.3 | v20.25,22 18,19.75 8.25,19.75 7,18.5 LCDHEADER.8
  Bottom 0.203: v33.5,49.25 32.75,48.5 32.75,34.5 v20.25,22
LED  (via drill 0.35)
  Top 0.203: LED1.C 59.75,41 60.75,42 63.25,42 63.5,42.25 63.5,52.5 v52.25,52.5 45.25,52.5 44.75,52 44.75,51.25 U1.38
  Bottom 0.203: v52.25,52.5 52.25,60.25 JP6.9
LED-A
  Top 0.203: R9.2 18.5,25.5 16.5,27.5 8,27.5 7,28.5 LCDHEADER.16
N$1  (via drill 0.35)
  Top 0.203: U1.9 38.25,45.75 30.5,45.75 30,46.25 L1.1 29.75,46.25 27.5,46.25 25.75,44.5 C1.1 25.5,44.25 25,44.25 v22.75,42 | v21,38.25 20,38.25 19.25,37.5 SJ2.1 | v24.25,33.25 27.25,33.25 C2.+
  Bottom 0.203: v22.75,42 22.75,40 v21,38.25 21,33.25 v24.25,33.25
N$2
  Top 0.203: R2.2 56.25,44.5 59.5,44.5 LED1.A
N$3
  Top 0.203: 87,59.25 85,61.25 IC1.2 | 87,59.25 92.5,59.25 C11.1 | JMP1.1 89.25,46.5 78.75,46.5 77,48.25 77,51.25 78.5,51.25 SJ3.1 78.75,51.5 84,51.5 85,52.5 L2.1 85.25,52.75 87,52.75 87,59.25
N$4  (via drill 0.35)
  Top 0.203: R3.2 71.5,28.5 71.75,28.5 71.75,25.25 R4.2 72,25 v73.25,23.75
  Bottom 0.203: v73.25,23.75 73.25,20.75 76,18 T1.2
N$5
  Top 0.203: IC2.2 84,42 88.25,42 TP5.TP 88.5,42 89.5,43 95.25,43 95.5,42.75 95.5,36.25 94,36.25 C12.+ 93.75,36.25 92.75,37.25 86.75,37.25 86.75,36.25 JMP2.1
N$6  (via drill 0.35)
  Top 0.203: v70.25,22.5 71.25,22.5 71.75,23 R4.1
  Bottom 0.203: v70.25,22.5 71,21.75 71,19.25 T2.3
N$7
  Top 0.203: 73,11.5 78,11.5 C13.1 | 73,11.5 72.75,11.5 R5.2 73,11.5 | 73,11.5 73,17.75 T2.2
N$8
  Top 0.203: R10.2 37.25,11 35,8.75 35,4.5 UART.2
N$9
  Top 0.203: 92.5,45.75 94.75,45.75 95.25,45.25 TP7.TP | 92.5,45.75 91.5,46.75 JMP1.2 | 92.5,45.75 85.5,45.75 84,44.25 IC2.3
N$10
  Top 0.203: R6.2 72.75,6.5 75,8.75 78,8.75 C13.2
N$11
  Top 0.203: T1.3 78.25,16.5 85.5,16.5 D2.C
  Bottom 0.203: L4.1 84.5,25.25 85.5,24.25 85.5,16.75 D2.C
N$12
  Top 0.203: D2.A 85.75,9 89,9 90,10 C14.- 90.25,10 97.5,10 97.75,9.75 L3.1
N$13
  Top 0.203: TP12.TP 89,27.75 89,24.25 IC3.2 | 98.5,14.5 98,14.5 L3.2 | 98.5,14.5 100.25,14.5 100.25,8.5 96.25,4.5 R8.2 | 98.5,14.5 98.5,20.75 C15.-
  Bottom 0.203: IC3.2 89,24 97.75,24 97.75,14.75 L3.2
N$16
  Top 0.203: R9.1 20.75,25.5 21.25,26 23.25,26 JMP3.2
N$17  (via drill 0.35)
  Top 0.203: v72.25,51.75 72.25,49.25 D1.A | J1.1 87.5,72.25 87,71.75 73.25,71.75 72,73 X2.2
  Bottom 0.203: v72.25,51.75 72,52 72,73 X2.2
N$18
  Top 0.203: R11.2 32.25,11 31.25,10 31.25,4.5 32.25,4.5 UART.3
N$21  (via drill 0.35)
  Top 0.203: 41.75,53.25 41.75,51.25 U1.44 | 41.75,53.25 41.75,55 TP1.TP | R1.2 56.75,35 56.75,40 52.75,40 SJ1.2 52.5,40 49.25,36.75 42.25,36.75 41.75,37.25 38.25,37.25 37.75,36.75 v28.25,36.75 | v28.5,53.25 41.75,53.25
  Bottom 0.203: v28.5,53.25 28.25,53 v28.25,36.75
N$22  (via drill 0.35)
  Top 0.203: U1.5 38.25,47.75 30.75,47.75 27.75,50.75 26,50.75 Q1.2 | v25.5,53.75 25.5,57.5 C7.1
  Bottom 0.203: v25.5,53.75 25.75,53.5 25.75,51 Q1.2
N$23
  Top 0.203: C8.1 20.75,57.5 18.75,57.5 16,54.75 TP2.TP 15.75,54.5 14,52.75 14,51 21,51 Q1.1 21.25,50.75 22.25,49.75 28,49.75 30.5,47.25 38.25,47.25 U1.6
N$25  (via drill 0.35)
  Top 0.203: v58.5,7.25 58.5,8.5 R12.2 | SIGGEN.1 56,3.75 58.25,3.75 SIGGEN.2
  Bottom 0.203: v58.5,7.25 58.5,4 SIGGEN.2
N$26  (via drill 0.35)
  Top 0.203: v27.25,7 29,7 TP18.TP | v19,9 19.25,9.25 19.75,9.25 X3.1 | v13.5,14.75 13.5,16.75 R17.2
  Bottom 0.203: v27.25,7 25.25,9 v19,9 19,9.25 v13.5,14.75
N$27
  Top 0.203: 20.25,4.75 18.75,4.75 18.5,5 14.25,5 14.25,12.25 14.5,12.5 14.5,17.5 13.5,18.5 R17.1 | 20.25,4.75 21.5,6 21.5,9.25 X3.3 | 20.25,4.75 24.5,4.75 24.75,5 30.25,5 30.25,8.25 27.25,11.25 27,11.25 27,17.75 R16.2
N$29
  Top 0.203: R15.2 22.75,16.75 18.5,12.5 15.25,12.5 14.75,12 14.75,11 15.75,11 16,11.25 20.5,11.25 20.75,11 20.75,9.5 X3.2
NRST  (via drill 0.35)
  Top 0.203: v36.75,46.5 37,46.75 38.25,46.75 U1.7 38.5,46.75 39.25,46.75 39.5,47 42.75,47 v43.75,48 | v36.75,37.5 26.25,37.5 25.75,38 C6.1 | v44,55.75 48,55.75 48.75,56.5 49.5,56.5 49.5,60.25 JP6.8
  Bottom 0.203: S1.2 46,10 46,3.75 S1.1 45.75,3.75 38.75,3.75 38.75,35.25 36.75,37.25 v36.75,37.5 v36.75,46.5 | v44,55.75 43.75,55.5 v43.75,48
RX1  (via drill 0.35)
  Top 0.203: v48.5,51.75 51,51.75 51.25,51.5 TP17.TP | v45.25,15.75 44,15.75 37.5,9.25 R10.1 | v49,47.5 48.75,47.25 46.75,47.25 U1.31
  Bottom 0.203: X4.33 48.75,66.5 48.25,66 48.25,59.25 48.5,59 v48.5,51.75 48,51.25 48,49 49,48 v49,47.5 49,19.5 v45.25,15.75
SWCLK  (via drill 0.35)
  Top 0.203: R13.2 63.5,22.5 63.25,22.25 59.25,22.25 JP3.3 | v49.75,51 48.25,51 47.75,51.5 45.5,51.5 45.25,51.25 U1.37
  Bottom 0.203: 50.5,51.75 v49.75,51 | 50.5,51.75 50.5,59 50.75,59.25 50.75,65.75 50.25,66.25 50.25,67 51,67.75 53.75,67.75 53.75,66.75 X4.37 | 50.5,51.75 50.5,22.25 59,22.25 JP3.3
SWDIO  (via drill 0.35)
  Top 0.203: R14.2 63.5,18.75 62.75,19.5 59.25,19.5 JP3.2 | v38.75,50.75 39.5,50 39.5,48.75 40,48.25 40.5,48.25 41,48.75 46.5,48.75 U1.34 | v38.25,64.5 40,66.25 40,68 50.25,68 51.25,69 X4.36
  Bottom 0.203: v38.75,50.75 38.25,51.25 v38.25,64.5 | JP3.2 59.25,19.75 61,21.5 61,54 55.75,59.25 55.75,65.75 55.25,66.25 55.25,69.5 54.25,70.5 51.5,70.5 51.5,69.25 X4.36
TESTSIG  (via drill 0.35)
  Top 0.203: 57,11.75 48.25,20.5 v40.5,20.5 | 57,11.75 58.25,10.5 R12.1 | v40.5,40.25 40.75,40.5 41.5,40.5 41.75,40.75 41.75,42.75 U1.17 | v57.25,70.5 45.25,70.5 44,69.25 X4.30 | 57,11.75 v61.5,16.25
  Bottom 0.203: v40.5,40.25 v40.5,20.5 | v57.25,70.5 61.5,66.25 v61.5,16.25
TL_PWM  (via drill 0.35)
  Top 0.203: v26.25,54.5 28.25,52.5 41.25,52.5 41.25,51.25 U1.45
  Bottom 0.203: v26.25,54.5 26.25,66.5 X4.15
TRIG  (via drill 0.35)
  Top 0.203: v62.25,46 62,46.25 46.75,46.25 U1.29
  Bottom 0.203: v62.25,46 62,46.25 62,66.75 57.5,71.25 47.5,71.25 47.5,68.5 46.5,67.5 46.5,66.75 X4.31
TX1  (via drill 0.35)
  Top 0.203: U1.30 46.75,46.75 49.25,46.75 51.25,48.75 TP16.TP 51.5,48.75 53.5,46.75 62.5,46.75 63,46.25 63,42.5 49.25,42.5 44.25,37.5 v42.5,37.5 | v42,18.75 32.5,9.25 R11.1
  Bottom 0.203: v42,18.75 41.75,19 41.75,37.25 42.25,37.75 | 42.25,37.75 42.75,38.25 42.75,49.25 43.25,49.75 43.25,64.5 45.25,66.5 45.25,68 46.25,69 X4.32 | 42.25,37.75 v42.5,37.5
USBDM  (via drill 0.35)
  Top 0.203: R15.1 22.75,18.75 24.75,20.75 TP19.TP 25,21 26,22 v42.5,22 | v43.75,46.75 44.75,47.75 46.5,47.75 U1.32
  Bottom 0.203: v43.75,46.75 43.75,45.75 44,45.5 | 44,45.5 45,44.5 46,44.5 46,59 45.75,59.25 45.75,64.5 47.75,66.5 47.75,68 48.75,69 X4.34 | v42.5,22 43.25,22.75 43.25,44.75 44,45.5
USBDP  (via drill 0.35)
  Top 0.203: R16.1 29,18 29.75,18 29.75,20.75 TP20.TP 30,21 30.25,21.25 48.25,21.25 v51.25,24.25 | v52,50.25 51.25,50.25 49.25,48.25 46.75,48.25 U1.33
  Bottom 0.203: X4.35 51.5,66.5 53.25,64.75 53.25,51.5 v52,50.25 52,25 v51.25,24.25
V-MON  (via drill 0.35)
  Top 0.203: R8.1 94.25,4.5 90,4.5 R7.1 89.75,4.25 87.25,1.75 63,1.75 | v39.25,40 40.25,41 41.25,41 41.25,42.75 U1.16 | v39.75,5 43,1.75 63,1.75 | 63,1.75 v63,2
  Bottom 0.203: v39.25,40 39.75,39.5 v39.75,5 | v63,2 63,71.75 47.25,71.75 45.25,69.75 45.25,69 44.75,68.5 44.75,67.5 44,66.75 X4.29
VGEN  (via drill 0.35)
  Top 0.203: v50,6 70.5,6 70.75,6.25 R6.1 | v41,49.75 41,50 40.75,50.25 40.75,51 U1.46 | v27.5,59.5 33,54 v39,54
  Bottom 0.203: v50,6 47.25,8.75 47.25,12.5 41.25,18.5 41.25,37.75 41,38 41,39.75 41.25,40 41.25,49.5 v41,49.75 41,52 v39,54 | X4.16 27.5,67.75 v27.5,59.5
VSENSEL1  (via drill 0.35)
  Top 0.203: v31.5,43.5 37.5,43.5 38.25,44.25 U1.12
  Bottom 0.203: v31.5,43.5 31,44 31,58.75 30.5,59.25 30.5,62.25 32.25,64 32.25,69.5 33.25,70.5 36,70.5 36,69.25 X4.24
VSENSEL2  (via drill 0.35)
  Top 0.203: v35.25,44.25 36.25,44.25 36.75,44.75 38.25,44.75 U1.11 | v33,64.5 34,65.5 37.5,65.5 38.5,66.5 X4.25
  Bottom 0.203: v35.25,44.25 35,44.5 35,49.25 33,51.25 v33,64.5

### Text on the board
tNames: By Yatin Khurana, MAIT / 00514807319 | 9V Max | STM32 Based Oscilloscope | Expansion/Aux Port | Buttons Port | 9V/5V PSU | SWD | DB2 Port | -5V PSU | Reset
bNames: Expansion/Aux Port